# EAGLE design cp32m4_wrover (EAGLE 9.3.0)
COMPANY: ADAFRUIT INDUSTRIES; DRAWN: KTOWN; REV: B
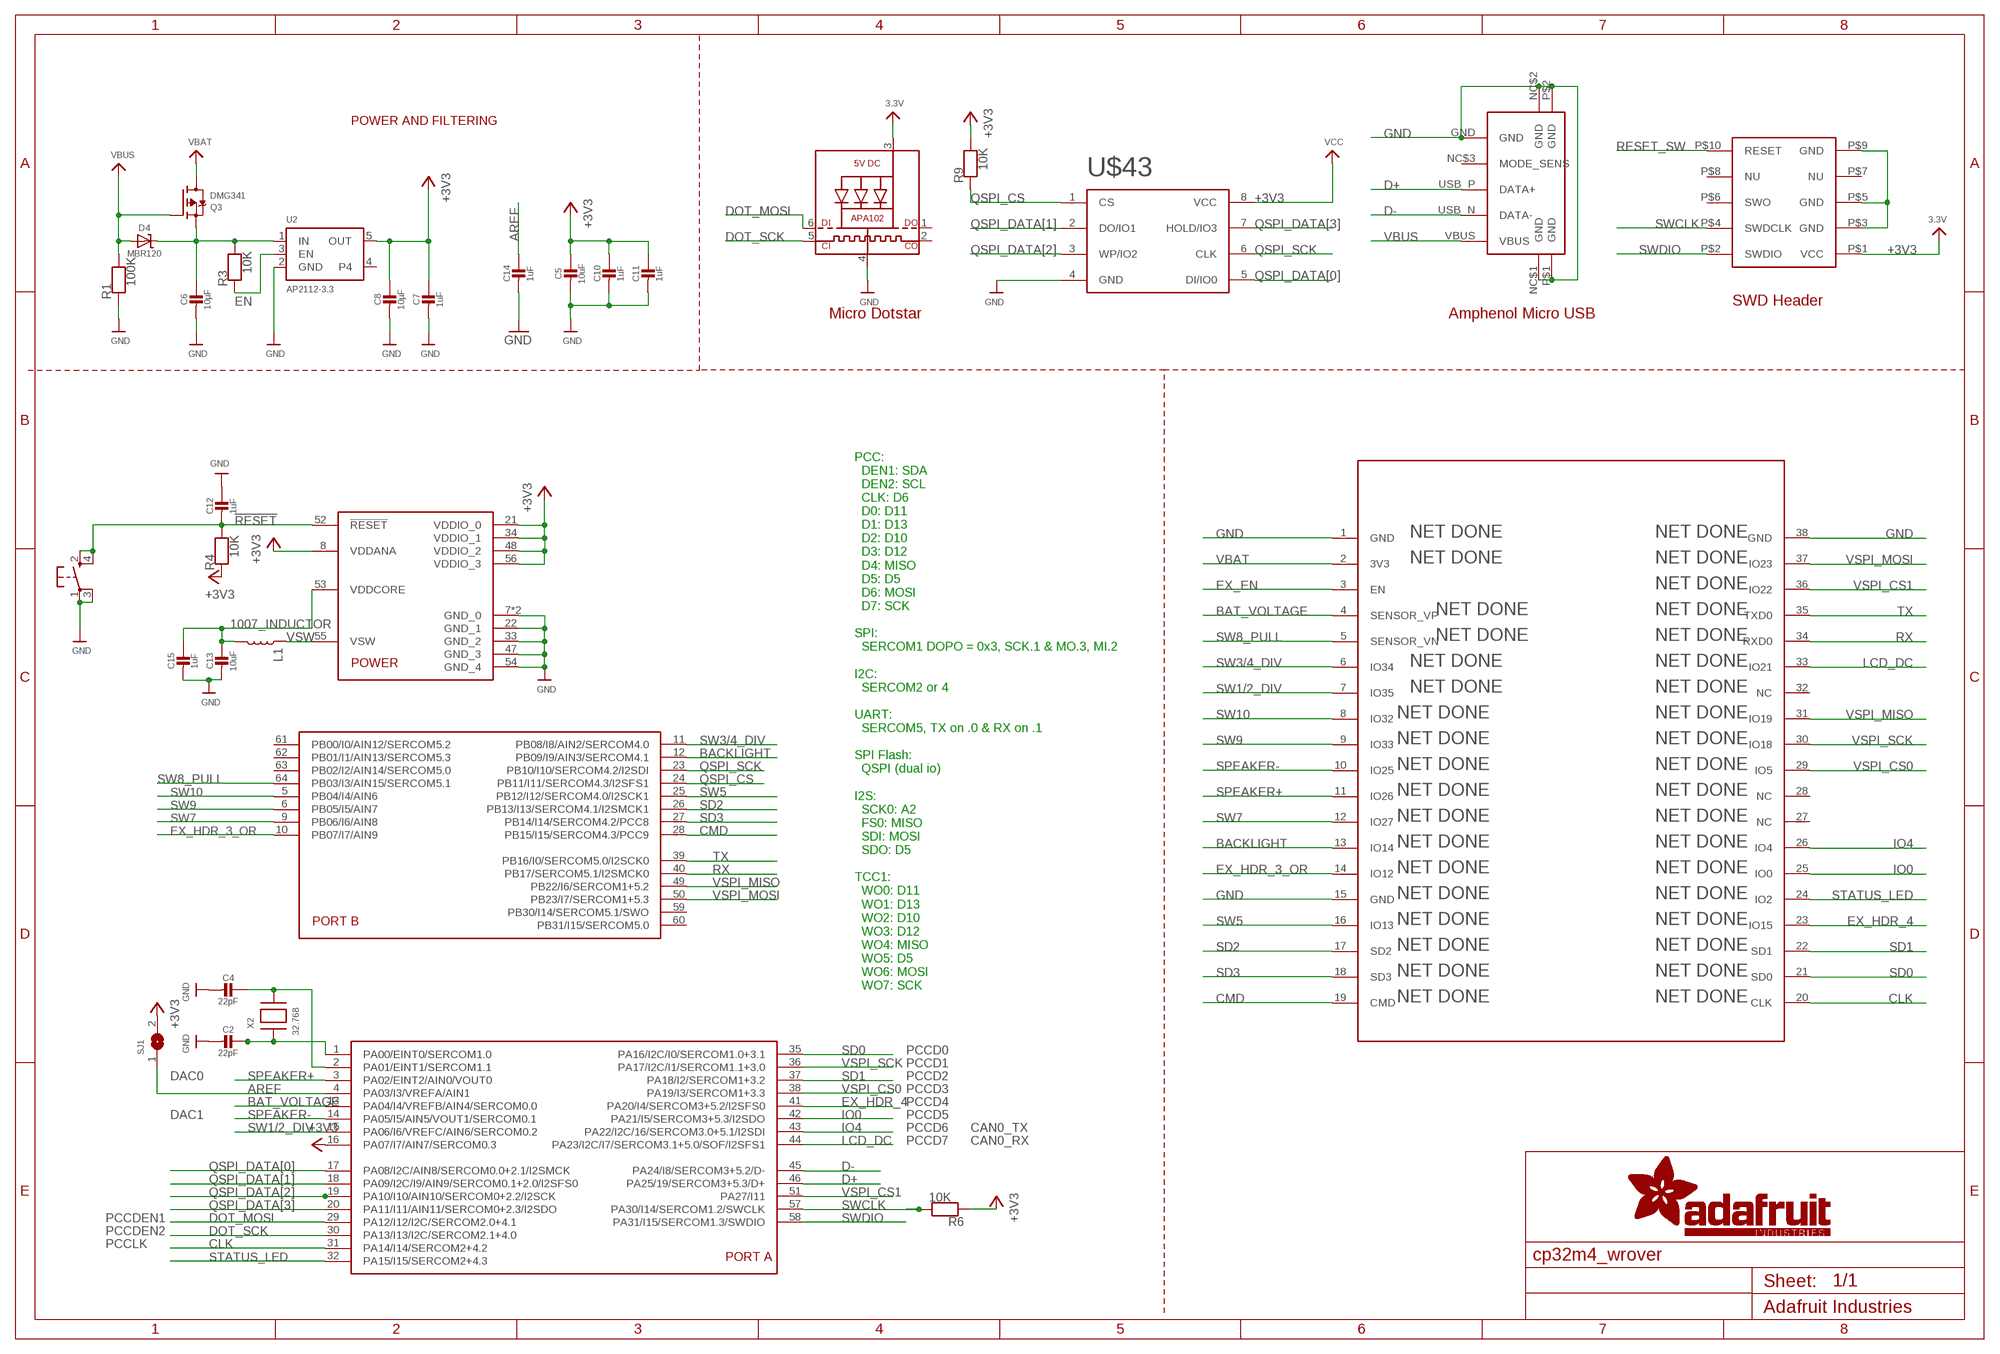
[diagram p0: schematic, sheet 1]

## Parts
C2  22pF  CAP_CERAMIC0603_NO  [0603-NO]
C4  22pF  CAP_CERAMIC0603_NO  [0603-NO]
C5  10uF  CAP_CERAMIC0805-NOOUTLINE  [0805-NO]
C6  10µF  CAP_CERAMIC0805-NOOUTLINE  [0805-NO]
C7  1uF  CAP_CERAMIC0603_NO  [0603-NO]
C8  10µF  CAP_CERAMIC0805-NOOUTLINE  [0805-NO]
C10  1uF  CAP_CERAMIC0603_NO  [0603-NO]
C11  1uF  CAP_CERAMIC0603_NO  [0603-NO]
C12  1uF  CAP_CERAMIC0603_NO  [0603-NO]
C13  10uF  CAP_CERAMIC0805-NOOUTLINE  [0805-NO]
C14  1uF  CAP_CERAMIC0603_NO  [0603-NO]
C15  1uF  CAP_CERAMIC0603_NO  [0603-NO]
D4  MBR120  DIODE-SCHOTTKYSOD-123  [SOD-123]
L1  1007_INDUCTOR  [1007_INDUCTOR]
LED2  AP102-2020  APA1022020  [APA102_2020]
Q3  DMG341  MOSFET-P  [SOT23-R]
R1  100K  RESISTOR_0603_NOOUT  [0603-NO]
R3  10K  RESISTOR_0603_NOOUT  [0603-NO]
R4  10K  RESISTOR_0603_NOOUT  [0603-NO]
R6  10K  RESISTOR_0603_NOOUT  [0603-NO]
R9  10K  RESISTOR_0603_NOOUT  [0603-NO]
SJ1  SOLDERJUMPERCLOSED  [SOLDERJUMPER_CLOSEDWIRE]
SW1  SPST_TACT-KMR2  [KMR2]
U2  AP2112-3.3  VREG_SOT23-5  [SOT23-5]
U$7  ESP32_WROVER  [ESP32_WROVER]
U$14  ATSAMD51J  [PQFN64-1]
U$43  WINDBOND_QSPI_FLASHWSON_6X5  [WSON_6X5MM]
U$44  SWD_HEADER  [AMPHENOL_SWD]
U$50  AMPHENOL_MICRO_USBAMPHENOL_MICRO_USB_BETTER  [BETTER_AMP_MICRO_USB]
X2  32.768  XTAL-3.2X1.5  [XTAL3215]

## Nets
!RESET: C12.2 R4.2 SW1.2(S) SW1.4(S1) U$14.52(!RESET)
+3V3: C5.1 C7.1 C8.1 C10.1 C11.1 LED2.3(VDD) R4.1 R6.1 R9.2 SJ1.2 U2.5(OUT) U$14.8(VDDANA) U$14.16(PA07/I7/AIN7/SERCOM0.3) U$14.21(VDDIO_0) U$14.34(VDDIO_1) U$14.48(VDDIO_2) U$14.56(VDDIO_3) U$43.8(VCC) U$44.P$1(VCC) ; supply symbol labelled 3.3V, VCC
AREF: C14.1 SJ1.1 U$14.4(PA03/I3/VREFA/AIN1)
BACKLIGHT: U$7.13(IO14) U$14.12(PB09/I9/AIN3/SERCOM4.1)
BAT_VOLTAGE: U$7.4(SENSOR_VP) U$14.13(PA04/I4/VREFB/AIN4/SERCOM0.0)
CLK: U$7.20(CLK) U$14.31(PA14/I14/SERCOM2+4.2)
CMD: U$7.19(CMD) U$14.28(PB15/I15/SERCOM4.3/PCC9)
D+: U$14.46(PA25/19/SERCOM3+5.3/D+) U$50.USB_P(DATA+)
D-: U$14.45(PA24/I8/SERCOM3+5.2/D-) U$50.USB_N(DATA-)
DOT_MOSI: LED2.6(DI) U$14.29(PA12/I12/I2C/SERCOM2.0+4.1)
DOT_SCK: LED2.5(CKI) U$14.30(PA13/I13/I2C/SERCOM2.1+4.0)
EN: R3.1 U2.3(EN)
EX_EN: U$7.3(EN)
EX_HDR_3_OR: U$7.14(IO12) U$14.10(PB07/I7/AIN9)
EX_HDR_4: U$7.23(IO15) U$14.41(PA20/I4/SERCOM3+5.2/I2SFS0)
GND [gnd]: C2.2 C4.2 C5.2 C6.2 C7.2 C8.2 C10.2 C11.2 C12.1 C13.2 C14.2 C15.2 LED2.4(GND) R1.1 SW1.1(P) SW1.3(P1) U2.2(GND) U$7.1(GND) U$7.15(GND) U$7.38(GND) U$14.7(GND_0) U$14.22(GND_1) U$14.33(GND_2) U$14.47(GND_3) U$14.54(GND_4) U$14.EXP(GND_0) U$43.4(GND) U$44.P$3(GND) U$44.P$5(GND) U$44.P$9(GND) U$50.GND U$50.NC$1(GND) U$50.NC$2(GND) U$50.P$1(GND) U$50.P$2(GND)
IO0: U$7.25(IO0) U$14.42(PA21/I5/SERCOM3+5.3/I2SDO)
IO4: U$7.26(IO4) U$14.43(PA22/I2C/16/SERCOM3.0+5.1/I2SDI)
LCD_DC: U$7.33(IO21) U$14.44(PA23/I2C/I7/SERCOM3.1+5.0/SOF/I2SFS1)
N$5: C2.1 U$14.1(PA00/EINT0/SERCOM1.0) X2.P$1
N$7: C4.1 U$14.2(PA01/EINT1/SERCOM1.1) X2.P$2
QSPI_CS: R9.1 U$14.24(PB11/I11/SERCOM4.3/I2SFS1) U$43.1(CS)
QSPI_DATA[0]: U$14.17(PA08/I2C/AIN8/SERCOM0.0+2.1/I2SMCK) U$43.5(DI/IO0)
QSPI_DATA[1]: U$14.18(PA09/I2C/I9/AIN9/SERCOM0.1+2.0/I2SFS0) U$43.2(DO/IO1)
QSPI_DATA[2]: U$14.19(PA10/I10/AIN10/SERCOM0+2.2/I2SCK) U$43.3(WP/IO2)
QSPI_DATA[3]: U$14.20(PA11/I11/AIN11/SERCOM0+2.3/I2SDO) U$43.7(HOLD/IO3)
QSPI_SCK: U$14.23(PB10/I10/SERCOM4.2/I2SDI) U$43.6(CLK)
RESET_SW: U$44.P$10(RESET)
RX: U$7.34(RXD0) U$14.40(PB17/SERCOM5.1/I2SMCK0)
SD0: U$7.21(SD0) U$14.35(PA16/I2C/I0/SERCOM1.0+3.1)
SD1: U$7.22(SD1) U$14.37(PA18/I2/SERCOM1+3.2)
SD2: U$7.17(SD2) U$14.26(PB13/I13/SERCOM4.1/I2SMCK1)
SD3: U$7.18(SD3) U$14.27(PB14/I14/SERCOM4.2/PCC8)
SPEAKER+: U$7.11(IO26) U$14.3(PA02/EINT2/AIN0/VOUT0)
SPEAKER-: U$7.10(IO25) U$14.14(PA05/I5/AIN5/VOUT1/SERCOM0.1)
STATUS_LED: U$7.24(IO2) U$14.32(PA15/I15/SERCOM2+4.3)
SW1/2_DIV: U$7.7(IO35) U$14.15(PA06/I6/VREFC/AIN6/SERCOM0.2)
SW3/4_DIV: U$7.6(IO34) U$14.11(PB08/I8/AIN2/SERCOM4.0)
SW5: U$7.16(IO13) U$14.25(PB12/I12/SERCOM4.0/I2SCK1)
SW7: U$7.12(IO27) U$14.9(PB06/I6/AIN8)
SW8_PULL: U$7.5(SENSOR_VN) U$14.64(PB03/I3/AIN15/SERCOM5.1)
SW9: U$7.9(IO33) U$14.6(PB05/I5/AIN7)
SW10: U$7.8(IO32) U$14.5(PB04/I4/AIN6)
SWCLK: R6.2 U$14.57(PA30/I14/SERCOM1.2/SWCLK) U$44.P$4(SWDCLK)
SWDIO: U$14.58(PA31/I15/SERCOM1.3/SWDIO) U$44.P$2(SWDIO)
TX: U$7.35(TXD0) U$14.39(PB16/I0/SERCOM5.0/I2SCK0)
VBAT [power]: Q3.3(D) U$7.2(3V3)
VBUS [power]: D4.A Q3.1(G) R1.2 U$50.VBUS
VDDCORE1: C13.1 C15.1 L1.P$2 U$14.53(VDDCORE)
VHI: C6.1 D4.C Q3.2(S) R3.2 U2.1(IN)
VSPI_CS0: U$7.29(IO5) U$14.38(PA19/I3/SERCOM1+3.3)
VSPI_CS1: U$7.36(IO22) U$14.51(PA27/I11)
VSPI_MISO: U$7.31(IO19) U$14.49(PB22/I6/SERCOM1+5.2)
VSPI_MOSI: U$7.37(IO23) U$14.50(PB23/I7/SERCOM1+5.3)
VSPI_SCK: U$7.30(IO18) U$14.36(PA17/I2C/I1/SERCOM1.1+3.0)
VSW: L1.P$1 U$14.55(VSW)
Unconnected: LED2.1(DO) LED2.2(CKO) U2.4 U$7.27(NC) U$7.28(NC) U$7.32(NC) U$14.59(PB30/I14/SERCOM5.1/SWO) U$14.60(PB31/I15/SERCOM5.0) U$14.61(PB00/I0/AIN12/SERCOM5.2) U$14.62(PB01/I1/AIN13/SERCOM5.3) U$14.63(PB02/I2/AIN14/SERCOM5.0) U$44.P$6(SWO) U$44.P$7(NU) U$44.P$8(NU) U$50.NC$3(MODE_SENS)

## Notes on the sheet
- POWER AND FILTERING
- SWD Header
- Micro Dotstar | Amphenol Micro USB
- NET DONE | NET DONE
- NET DONE | NET DONE
- NET DONE
- NET DONE | NET DONE
- NET DONE | NET DONE
- NET DONE | NET DONE
- NET DONE | NET DONE
- NET DONE | NET DONE
- NET DONE | NET DONE
- NET DONE | NET DONE
- NET DONE | NET DONE
- NET DONE | NET DONE
- NET DONE | NET DONE
- NET DONE | NET DONE
- NET DONE | NET DONE
- NET DONE | NET DONE
- NET DONE | NET DONE
- NET DONE | NET DONE
- PCC:
    DEN1: SDA
    DEN2: SCL
    CLK: D6
    D0: D11
    D1: D13
    D2: D10
    D3: D12
    D4: MISO
    D5: D5
    D6: MOSI
    D7: SCK
  
  SPI:
    SERCOM1 DOPO = 0x3, SCK.1 & MO.3, MI.2
  
  I2C:
    SERCOM2 or 4
  
  UART:
    SERCOM5, TX on .0 & RX on .1
  
  SPI Flash:
    QSPI (dual io)
  
  I2S:
    SCK0: A2
    FS0: MISO
    SDI: MOSI
    SDO: D5
  
  TCC1:
    WO0: D11
    WO1: D13
    WO2: D10
    WO3: D12
    WO4: MISO
    WO5: D5
    WO6: MOSI
    WO7: SCK
- NET DONE | NET DONE
- PCCD0
- PCCD1
- DAC0 | PCCD2
- PCCD3
- PCCD4
- DAC1 | PCCD5
- PCCD6 | CAN0_TX
- PCCD7 | CAN0_RX
- PCCDEN1
- PCCDEN2
- PCCLK

## Library data of the parts
C2 C4-C8 C10-C15 = microbuilder:CAP_CERAMIC: Ceramic Capacitors For new designs, use the packages preceded by an '_' character since they are more reliable: The following footprints should be used on most boards: _0402 - Standard footprint for regular board layouts _0603 - Standard footprint for regular board layouts _0805 - Standard footprint for regular board layouts _1206 - Standard footprint for regular board layouts For extremely tight-pitch boards where space is at a premium, the following 'micro-pitch' footprints can be used (smaller pads, no silkscreen outline, etc.): _0402MP - Micro-pitch footprint for very dense/compact boards _0603MP - Micro-pitch footprint for very dense/compact boards _0805MP - Micro-pitch footprint for very dense/compact boards _1206MP - Micro-pitch footprint for very dense/compact boards
D4 = microbuilder:DIODE-SCHOTTKY
L1 = 00_bsiepert:1007_INDUCTOR
LED2 = microbuilder:APA102: APA102/DotStar Pixels VCC: 5V DC Refresh Rate: 400Hz
Q3 = microbuilder:MOSFET-P: P-Channel Mosfet LEGEND VDS: Voltage Drain-Source ID: Drain Current RDS(ON): Drain-Source On-State Resistance VGS(TH): Gate-Source Threshold Voltage CISS: Drain-Source Input Capacitance SOT-23 Name VDS ID RDS(ON) VGS(TH) CISS Order Number IRLML5103 30V 760mA 600 mOhm -- 75pF @ 25V Digikey: IRLML5103PBFCT-ND IRLML6401 12V 4.3A 50 mOhm 950mV @ 250µA 830pF @ 10V Digikey: IRLML6401PBFTR-ND NTR0202PL 20V 400mA 800 mOhm 2.3V @ 250uA 70pF @ 5V Digikey: NTR0202PLT1GOSTR-ND NTR4101PT1G 20V 1.8A 85 mOhm 1.2V @ 250uA 675pF @ 10V Digikey: NTR4101PT1GOSCT-ND DMP2004K 20V 600mA 900 mOhm 1V @ 250uA 175pF @ 16V Digikey: DMP2004KDICT-ND PMV65XP 20V 3.9A 76 mOhm 950mV @ 1mA 725pF @ 20V Digikey: 568-2358-2-ND TO-252 Name VDS ID RDS(ON) VGS(TH) CISS Order Number AOD417 30V 25A 34 mOhm 3V @ 250µA 920pF @ 15V Digikey: 785-1106-2-ND PowerPak Name VDS ID RDS(ON) VGS(TH) CISS Order Number AON7401 30V 12A 14 mOhm 3V @ 250µA 2600pF @ 15V Digikey: 785-1302-1-ND
R1 R3 R4 R6 R9 = microbuilder:RESISTOR: Resistors For new designs, use the packages preceded by an '_' character since they are more reliable: The following footprints should be used on most boards: _0402 - Standard footprint for regular board layouts _0603 - Standard footprint for regular board layouts _0805 - Standard footprint for regular board layouts _1206 - Standard footprint for regular board layouts For extremely tight-pitch boards where space is at a premium, the following 'micro-pitch' footprints can be used (smaller pads, no silkscreen outline, etc.): _0402MP - Micro-pitch footprint for very dense/compact boards _0603MP - Micro-pitch footprint for very dense/compact boards _0805MP - Micro-pitch footprint for very dense/compact boards _1206MP - Micro-pitch footprint for very dense/compact boards
SJ1 = microbuilder:SOLDERJUMPER: SMD Solder JUMPER Solder the two pads together to create a connection, or remove the solder to break it. REFLOW - Use this footprint for solder paste and reflow ovens. WAVE - Use this footprint for hand-soldering (larger pads). CLOSED - Has a trace between the two pads to ensure it is closed by default. The trace needs to be cut to disable the jumper, and can be closed again by creating a solder bridge between the two pads.
SW1 = adafruit:SPST_TACT: SMT 6mm switch, EVQQ2 series http://www.ladyada.net/library/eagle
U2 = microbuilder:VREG_SOT23-5: SOT23-5 Fixed Voltage Regulators Part Current Out V Out V In V Dropout θJA (°C/W) TJ (°C) Digikey Part No. ADP121 150mA 3.3V 3.4-5.5V 0.09V @ 150mA -- -- ADP121-AUJZ33R7CT-ND ADP121 150mA 3.0V 3.1-5.5V 0.09V @ 150mA -- -- ADP121-AUJZ30R7CT-ND ADP122 300mA 3.3V 3.4-5.5V 0.085V @ 300mA -- -- ADP122AUJZ-3.3-R7CT-ND ADP1712 300mA 3.3V 3.5-5.5V 0.17V @ 300mA -- -- ADP1712AUJZ-3.3-R7TR-ND AP7311 (Low Cost) 150mA 3.3V 3.5-6V 0.15V @ 150mA -- -- AP7311-33WG-7DICT-ND LD39015M18R 150mA 1.8V 1.9V-5.5V 0.08V @ 100mA -- -- 497-6977-1-ND LP2985A-33DBVR 150mA 3.3V 3.3-16V 0.28V @ 150mA 206 150 296-18479-1-ND MCP1824T-3302E/OT 300mA 3.3V 3.5V-6V 0.2V @ 300mA -- -- MCP1824T-3302E/OTCT-ND MIC5205-2.5YM5 TR 150mA 2.5V 2.7-16V 0.165V @ 150mA -- -- 576-1257-2-ND MIC5205-3.0YM5 TR 150mA 3.0V 3.2V-16V 0.165V @ 150mA -- -- 576-1258-2-ND MIC5205-3.3YM5 TR 150mA 3.3V 3.5V-16V 0.165V @ 150mA -- -- 576-1259-2-ND TPS780330220 150mA 3.3V+2.2V 3.6-5.5V 250mV Max -- -- 296-23332-1-ND TDA3663/N1,135 100mA 3.3V 3.5-45V 0.18V @ 50mA -- -- 568-5343-1-ND Max operating temp can be calculated using θJA, TJ (max junction temperature), and power in watts. Set the "Maximum Ambient Temperature" until it reaches TJ ("Max Junction Temperature"), which is the absolute limit for safe use of the regulator: Heat Sink Temperature Calculator <http://www.daycounter.com/Calculators/Heat-Sink-Temperature-Calculator.phtml> For example, With 12V source into a 3.3V LP2985 and a 30mA load, we are dissipating (12V-3.3V) * 0.03A = 0.261W. With a θJA of 206 °C/W, a TJ of 150°C, and 261mW we can safely use the chip without a heat sink up to 75°C (=147.1°C Junction Temperature).
U$7 = 00_bsiepert:ESP32_WROVER
U$14 = microbuilder:ATSAMD51J: ATSAMD51J cortex m4 microcontroller
U$43 = 00_bsiepert:WINDBOND_QSPI_FLASH
U$44 = 00_bsiepert:SWD_HEADER
U$50 = 00_bsiepert:AMPHENOL_MICRO_USB
X2 = adafruit2:XTAL: Low cost SMT crystals, no capacitors included http://www.ladyada.net/library/eagle

## Net classes
1 power: width 0.305 mm
2 gnd: width 0.254 mm

## Board
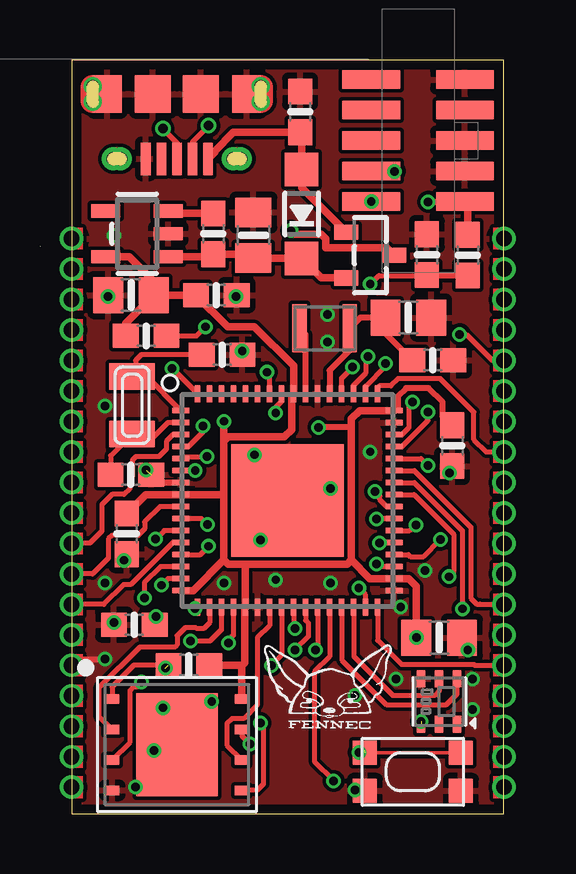
[diagram p1: board, top side]
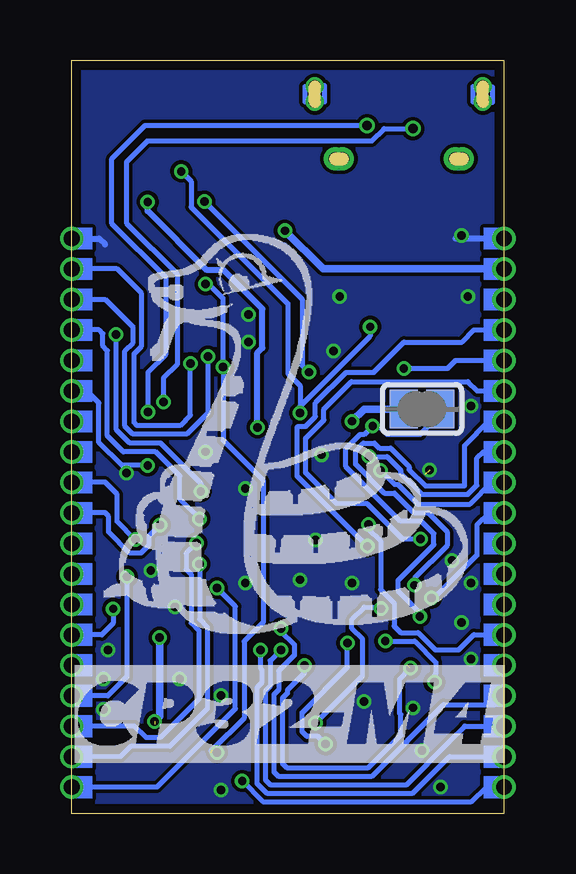
[diagram p2: board, bottom side, seen from below]

Size 18 x 31.4 mm. Coordinates in mm from the lower left corner, seen from the top.
Outline: 14.4,31.4 8.05,31.4
Copper layers (1*16): Top 0.035559375mm / dielectric 1.6mm / Bottom 0.035559375mm
Design rules "oshpark-2layer-tented *": minimum track width 6mil, minimum drill 10mil, track to track 6mil, track to pad 6mil, pad to pad 6mil, via to via 6mil, smd to smd 6mil, copper to edge 15mil, drill to drill 6mil, minimum pad ring 5mil, minimum via ring 5mil, stop-mask expansion 2.5mil, vias tented up to drill 20mil, thermal gap 10mil

### Footprints (pad centres in the part's own frame; a part is rotated, then mirrored left to right if it is on the bottom)
0603-NO = smd 1.075 x 1: 1 -0.85,0; 2 0.85,0
0805-NO = smd 1.24 x 1.5: 1 -0.95,0; 2 0.95,0
SOD-123 = smd 1.4 x 1.4: A 1.85,0; C -1.85,0
1007_INDUCTOR = smd 0.6 x 2: P$1 -1.05,0; P$2 1.05,0
APA102_2020 = smd 0.7 x 0.35: 1 -0.95,-0.75; 2 -0.95,0; 3 -0.95,0.75; 4 0.95,0.75; 5 0.95,0; 6 0.95,-0.75
SOT23-R = smd 0.635 x 1.016: 1 -0.95,-1; 2 0.95,-1; 3 0,1
SOLDERJUMPER_CLOSEDWIRE = smd 1.168 x 1.6: 1 -0.762,0; 2 0.762,0 | smd 0.635 x 0.203: WIRE 0,0
KMR2 = smd 1 x 1: 1 2,0.8; 2 2,-0.8; 3 -2,0.8; 4 -2,-0.8
SOT23-5 = smd 0.55 x 1.2: 1 -0.95,-1.3; 2 0,-1.3; 3 0.95,-1.3; 4 0.95,1.3; 5 -0.95,1.3
ESP32_WROVER = drill 0.65 pad 0.904: 1 -9.009,15.36; 2 -9.009,14.09; 3 -9.009,12.82; 4 -9.009,11.55; 5 -9.009,10.28; 6 -9.009,9.01; 7 -9.009,7.74; 8 -9.009,6.47; 9 -9.009,5.2; 10 -9.009,3.93; 11 -9.009,2.66; 12 -9.009,1.39; 13 -9.009,0.12; 14 -9.009,-1.15; 15 -9.009,-2.42; 16 -9.009,-3.69; 17 -9.009,-4.96; 18 -9.009,-6.23; 19 -9.009,-7.5; 20 9.009,-7.5; 21 9.009,-6.23; 22 9.009,-4.96; 23 9.009,-3.69; 24 9.009,-2.42; 25 9.009,-1.15; 26 9.009,0.12; 27 9.009,1.39; 28 9.009,2.66; 29 9.009,3.93; 30 9.009,5.2; 31 9.009,6.47; 32 9.009,7.74; 33 9.009,9.01; 34 9.009,10.28; 35 9.009,11.55; 36 9.009,12.82; 37 9.009,14.09; 38 9.009,15.36
PQFN64-1 = smd 0.7 x 0.22: 1 -4.45,3.75; 2 -4.45,3.25; 3 -4.45,2.75; 4 -4.45,2.25; 5 -4.45,1.75; 6 -4.45,1.25; 7 -4.45,0.75; 8 -4.45,0.25; 9 -4.45,-0.25; 10 -4.45,-0.75; 11 -4.45,-1.25; 12 -4.45,-1.75; 13 -4.45,-2.25; 14 -4.45,-2.75; 15 -4.45,-3.25; 16 -4.45,-3.75; 33 4.45,-3.75; 34 4.45,-3.25; 35 4.45,-2.75; 36 4.45,-2.25; 37 4.45,-1.75; 38 4.45,-1.25; 39 4.45,-0.75; 40 4.45,-0.25; 41 4.45,0.25; 42 4.45,0.75; 43 4.45,1.25; 44 4.45,1.75; 45 4.45,2.25; 46 4.45,2.75; 47 4.45,3.25; 48 4.45,3.75 | smd 0.22 x 0.7: 17 -3.75,-4.45; 18 -3.25,-4.45; 19 -2.75,-4.45; 20 -2.25,-4.45; 21 -1.75,-4.45; 22 -1.25,-4.45; 23 -0.75,-4.45; 24 -0.25,-4.45; 25 0.25,-4.45; 26 0.75,-4.45; 27 1.25,-4.45; 28 1.75,-4.45; 29 2.25,-4.45; 30 2.75,-4.45; 31 3.25,-4.45; 32 3.75,-4.45; 49 3.75,4.45; 50 3.25,4.45; 51 2.75,4.45; 52 2.25,4.45; 53 1.75,4.45; 54 1.25,4.45; 55 0.75,4.45; 56 0.25,4.45; 57 -0.25,4.45; 58 -0.75,4.45; 59 -1.25,4.45; 60 -1.75,4.45; 61 -2.25,4.45; 62 -2.75,4.45; 63 -3.25,4.45; 64 -3.75,4.45 | smd 4.7 x 4.7: EXP 0,0
WSON_6X5MM = smd 0.6 x 0.4: 1 -2.7,1.905; 2 -2.7,0.635; 3 -2.7,-0.635; 4 -2.7,-1.905; 5 2.7,-1.905; 6 2.7,-0.635; 7 2.7,0.635; 8 2.7,1.905 | smd 3.4 x 4.3: PAD 0,0
AMPHENOL_SWD = smd 0.76 x 2.4: P$1 -2.54,-1.95; P$2 -2.54,1.95; P$3 -1.27,-1.95; P$4 -1.27,1.95; P$5 0,-1.95; P$6 0,1.95; P$7 1.27,-1.95; P$8 1.27,1.95; P$9 2.54,-1.95; P$10 2.54,1.95
BETTER_AMP_MICRO_USB = smd 0.4 x 1.35: GND 1.3,2.7; NC$3 0.65,2.7; USB_N -0.65,2.7; USB_P 0,2.7; VBUS -1.3,2.7 | smd 1.5 x 1.55: NC$1 -1,0; NC$2 1,0 | smd 1.2 x 1.55: P$1 -2.9,0; P$2 2.9,0 | drill 0.5: P$3 -3.5,0.325; P$4 -3.5,-0.325; P$5 3.5,-0.325; P$6 3.5,0.325 | drill 0.55 pad 0.95: P$7 -2.65,2.7; P$8 -2.35,2.7; P$9 2.35,2.7; P$10 2.65,2.7
XTAL3215 = smd 1.1 x 1.9: P$1 1.2,0; P$2 -1.2,0

### Placement (x,y rotation side)
C2  6.26,19.12 0 top
C4  2.46,14.12 0 top
C5  15.3,7.33 0 top
C6  7.56,24.1 90 top
C7  6.02,21.6 0 top
C8  2.46,21.6 180 top
C10  2.28,11.66 270 top
C11  15.85,15.33 270 top
C12  14.79,23.29 270 top
C13  14.02,20.66 0 top
C14  2.6,7.87 180 top
C15  15.03,18.89 0 top
D4  9.57,24.98 90 top
L1  10.52,20.22 0 top
LED2  15.3,4.67 90 top
Q3  12.43,23.27 270 top
R1  9.51,29.24 270 top
R3  5.89,24.16 270 top
R4  16.49,23.27 270 top
R6  3.09,19.9 0 top
R9  4.87,6.19 0 top
SJ1  3.41,16.85 180 bottom
SW1  14.21,1.74 180 top
U2  2.71,24.16 90 top
U$7  9,8.6 0 top
U$14  8.99,13.04 0 top
U$43  4.38,2.87 0 top
U$44  14.42,28.04 90 top
U$50  4.37,29.98 180 top
X2  2.51,17.02 90 top

### Tracks (layer width: path | path; a pad name or v marks a point on that pad's centre or on a via)
!RESET  (via drill 0.35)  (1 unrouted)
  Top 0.152: SW1.2 SW1.4
  Top 0.203: U$14.52 11.24,18.14 v11.7,18.6 | v12.43,22.06 12.79,22.42 14.82,22.42
  Top 0.254: R4.2 14.82,22.42 C12.2 | SW1.2 12.3,2.63 | 16.12,2.63 SW1.4
  Bottom 0.203: v12.43,22.06 12.3,22.06 11.7,21.46 v11.7,18.6 11.7,15.55 10.04,13.89 10.04,7.97 10.83,7.18 10.83,3.98 12.18,2.63
  Bottom 0.254: 12.18,2.63 12.04,2.63 v11.95,2.54
+3V3  (via drill 0.35)  (1 unrouted)
  Top 0.254: C11.1 15.44,16.59 15.44,17.15 14.87,17.73 13.93,17.73 13.59,17.39 13.59,16.94 U$14.48 | 11.64,16.09 v10.27,16.09 | v14.84,25.49 16.36,25.49 U$44.P$1
  Top 0.305: 1.61,23.21 U2.5 2.39,23.21 3.41,22.19 C8.1 | C8.1 C7.1 6.48,20.28 7.6,20.28 9.24,18.65 U$14.56 9.15,17.41 9.15,16 8.85,15.7 6.51,15.7 6.33,15.52 | U$44.P$1 16.49,25.38 R4.1 | 6.33,10.57 6.51,10.39 7.22,10.39 | 6.33,13.3 6.33,15.52 | 6.33,13.3 6.33,10.57 | 7.22,10.39 7.22,8.61 U$14.21 7.2,8.56 7.2,6.29 7.08,6.17 | 6.33,13.3 6.33,13.29 U$14.8 3.07,13.29 C10.1 | 7.22,10.39 11.46,10.39 11.64,10.57 | U$14.48 11.99,16.8 11.64,16.45 11.64,16.09 11.64,10.57 | 11.64,10.57 12.41,9.79 U$14.34 14.03,9.79 14.35,9.47 C5.1 | 6.33,15.52 v6.33,16.35 | 6.33,10.57 5.06,9.29 U$14.16 | 7.08,6.17 7.08,6.19 R9.2 | 7.08,6.17 U$43.8 | C8.1 2.24,20.43 R6.1 | 15.47,16.56 C11.1
  Bottom 0.254: v10.27,16.09 10.27,19.21 10.07,19.41 10.07,21.03 11.68,22.64 12.38,22.64 14.84,25.11 v14.84,25.49
  Bottom 0.305: v6.33,16.35 5.82,16.85 SJ1.2 | C5.1 14.35,4.05 v14.55,3.84
  other vias: 14.35,7.33
AREF  (via drill 0.35)
  Top 0.203: U$14.4 4.86,15.3 5.47,15.91 v5.47,16.14 | v3.51,8.22 3.45,8.16 C14.1
  Bottom 0.203: SJ1.1 2.84,16.66 2.84,16.45 3.48,15.8 4.86,15.8 5.21,16.14 v5.47,16.14 5.82,15.79 6,15.79 6.59,15.2 6.59,14.45 4.31,12.18 3.44,12.18 2.92,11.66 2.92,11.2 4.41,9.71 4.41,9.28 3.51,8.38 v3.51,8.22
BACKLIGHT
  Top 0.203: U$14.12 4.19,11.29 2.44,9.54 2.16,9.54 1.33,8.72 U$7.13
BAT_VOLTAGE  (via drill 0.35)
  Top 0.203: U$14.13 5.35,10.79 v5.69,11.14
  Bottom 0.203: U$7.4 1.24,20.15 1.74,19.65 4.17,19.65 5.44,18.38 6.59,18.38 7.86,17.11 7.86,16.54 8.26,16.13 8.58,16.13 8.62,16.09 8.62,14.06 v5.69,11.14
CLK  (via drill 0.35)
  Top 0.203: U$14.31 12.24,9.11 v11.95,9.4
  Bottom 0.203: v11.95,9.4 11.19,8.64 11.19,4.38 14.46,1.11 U$7.20
CMD  (via drill 0.35)
  Top 0.203: v10.91,1.36 10.1,2.16 10.1,5.91 10.74,6.54 U$14.28
  Bottom 0.203: U$7.19 0.74,1.11 1.36,0.49 10.04,0.49 v10.91,1.36
D+  (via drill 0.35, 0.39)
  Top 0.203: U$50.USB_P 4.38,27.96 v3.79,28.54 | U$14.46 13.76,15.8 14.04,16.08 14.04,17 v14.19,17.15
  Bottom 0.203: v3.79,28.54 4.99,28.54 5.5,28.03 14.84,28.03 15.73,27.14 15.73,24.6 13.62,22.49 13.62,18.71 14.19,18.14 v14.19,17.15
D-  (via drill 0.35, 0.39)
  Top 0.203: U$50.USB_N 5.03,27.99 v5.7,28.67 | U$14.45 13.77,15.3 14.83,16.37 v14.83,16.74
  Bottom 0.203: v5.7,28.67 14.96,28.67 16.34,27.29 16.34,24.58 14.08,22.32 14.08,19.14 14.83,18.39 v14.83,16.74
DOT_MOSI
  Top 0.203: U$14.29 11.25,8.59 11.25,6.39 13.1,4.54 15.6,4.54 16.05,4.98 LED2.6
DOT_SCK
  Top 0.203: U$14.30 11.75,8.59 11.75,6.55 13.38,4.92 15.11,4.92 15.3,5.11 LED2.5
EN
  Top 0.305: R3.1 4.11,25.01 U2.3
EX_HDR_3_OR  (via drill 0.35)
  Top 0.203: v5.65,12.04 5.39,12.29 U$14.10
  Bottom 0.203: U$7.14 1.25,7.46 1.89,6.82 2.86,6.82 3.58,7.54 4.3,7.54 4.57,7.81 4.57,8.77 5.14,9.33 5.14,11.37 5.65,11.88 v5.65,12.04
EX_HDR_4  (via drill 0.35)
  Top 0.203: U$14.41 14.26,13.29 15.91,11.64 15.91,10.07 v15.71,9.87
  Bottom 0.203: v15.71,9.87 15.71,5.7 16.5,4.91 U$7.23
GND  (via drill 0.35)  (1 unrouted)
  Top 0.254: U$7.15 0.25,6.44 v1.38,6.44 | U$14.7 3.64,13.79 C4.2 | v5.82,4.66 4.05,4.66 v3.79,4.41 | v3.41,2.63 3.29,2.5 3.29,1.61 2.78,1.11 v2.65,1.11 | U$14.EXP 9.49,13.55 v10.78,13.55 | U$14.EXP 7.86,11.92 v7.86,11.39 | U$14.EXP 8.99,13.57 v7.6,14.95
  Bottom 0.254: U$7.1 2.01,23.96 2.01,23.97 | U$7.38 16.87,23.96 16.62,23.71
  other vias: 8.49,9.74 6.33,9.62 11.79,4.92 14.71,10.12 6.84,21.55 1.38,16.98 11.79,0.98 2.17,10.56 3.09,14.31 10.65,19.65 10.65,20.79 7.09,19.27 15.73,14.19 10.78,9.62 13.7,8.6 1.51,21.55 1.76,24.09 1.76,7.96 16.49,6.82 16.68,5.62 16.68,4.35 13.51,5.62 12.43,15.08 1.38,9.62
  pour Bottom: -0.02,31.59 18.02,31.59 18.02,-0.16 -0.02,-0.16
  pour Top: -0.02,31.46 18.02,31.46 18.02,-0.04 -0.02,-0.04
IO0  (via drill 0.35)
  Top 0.203: U$14.42 13.45,13.79 14.27,13.79 16.26,11.79 16.26,8.83 16.28,8.82 v16.28,8.53
  Bottom 0.203: v16.28,8.53 16.28,7.92 16.75,7.45 U$7.25
IO4
  Top 0.203: U$14.43 13.45,14.29 14.27,14.29 16.62,11.94 16.62,8.98 16.87,8.73 17,8.73 17.01,8.72 U$7.26
LCD_DC  (via drill 0.35)
  Top 0.203: U$14.44 14.55,14.79 v14.84,14.51
  Bottom 0.203: v14.84,14.51 15.92,14.51 16.87,15.46 16.87,17.11 17.38,17.61 U$7.33
N$5
  Top 0.203: U$14.1 3.11,18.22 2.65,18.22 | 2.65,18.22 X2.P$1 | C2.1 2.88,19.12 2.65,18.89 2.65,18.22
N$7
  Top 0.203: U$14.2 3.99,16.3 3.29,15.58 2.74,15.58 X2.P$2 1.61,14.92 C4.1
QSPI_CS  (via drill 0.35)  (1 unrouted)
  Top 0.203: U$14.24 8.74,6.6 v8.31,6.17 | R9.1 2.58,6.19 1.68,5.28 U$43.1
  Bottom 0.203: v8.31,6.17 8.31,5.86 9.03,5.14 9.03,5.01 9.23,4.81 9.23,2.1 9.05,1.92 5.64,1.92 4.3,3.26 4.3,4.13 4.35,4.18 4.35,5.61 v3.9,6.06
QSPI_DATA[0]  (via drill 0.35)
  Top 0.203: U$14.17 5.18,8.59 v5.13,8.54 | U$43.5 7.72,0.97 7.98,1.23 7.98,3.65 v7.86,3.77
  Bottom 0.203: v7.86,3.77 5.89,5.74 5.89,7.27 6.33,7.71 6.33,8.09 5.82,8.6 5.19,8.6 v5.13,8.54
QSPI_DATA[1]
  Top 0.203: U$14.18 5.74,7.95 5.49,7.71 5.2,7.71 5.17,7.74 4.71,7.74 4.39,7.41 4.39,7.03 4.3,6.94 2.83,6.94 1.12,5.23 1.12,4.06 U$43.2
QSPI_DATA[2]  (via drill 0.35)
  Top 0.203: U$14.19 6.23,8.59 6.23,7.66 5.75,7.18 v4.94,7.18 | U$43.3 2.42,2.98 2.42,5.13 2.57,5.28 2.7,5.28 v2.9,5.48
  Bottom 0.203: v2.9,5.48 2.9,5.76 2.83,5.83 2.83,6.29 3.73,7.18 v4.94,7.18
QSPI_DATA[3]  (via drill 0.35)
  Top 0.203: U$43.7 7.08,3.24 v7.43,2.89 | v6.53,7.11 6.53,7.24 6.74,7.45 U$14.20
  Bottom 0.203: v7.43,2.89 7.75,3.22 8.21,3.22 8.41,3.42 8.41,4.21 6.53,6.09 v6.53,7.11
QSPI_SCK
  Top 0.203: U$43.6 6.46,2.85 6.46,3.75 6.67,3.96 7.15,3.96 7.73,4.54 7.73,7.33 8.24,7.84 U$14.23
RX  (via drill 0.35)
  Top 0.203: v12.63,13.43 12.83,13.23 12.83,13.08 13.12,12.79 U$14.40 | v16.16,19.97 16.43,19.97 17.52,18.88 U$7.34
  Bottom 0.203: v12.63,13.43 12.63,13.75 14.31,15.43 15.59,15.43 16.15,16 v16.15,19.96 v16.16,19.97
SD0  (via drill 0.35)
  Top 0.203: U$14.35 12.79,10.29 v12.68,10.4
  Bottom 0.203: v12.68,10.4 12.68,8.1 12.36,7.77 12.36,4.37 13.92,2.81 15.56,2.81 15.98,2.38 U$7.21
SD1  (via drill 0.35)
  Top 0.203: U$14.37 12.83,11.29 v12.81,11.27
  Bottom 0.203: v12.81,11.27 13.24,10.84 13.24,10.17 13.04,9.97 13.04,7.95 12.71,7.62 12.71,4.77 14.32,3.16 14.91,3.16 15.4,3.65 U$7.22
SD2  (via drill 0.35)
  Top 0.203: U$14.26 9.74,8.05 9.85,7.94 9.85,7.38 v9.29,6.82
  Bottom 0.203: v9.29,6.82 9.74,6.37 9.74,5.3 9.94,5.1 9.94,1.4 9.74,1.21 4.05,1.21 2.27,2.98 2.27,3.01 1.63,3.65 1.63,3.64 U$7.17
SD3  (via drill 0.35)
  Top 0.203: U$14.27 10.24,6.82 v10.14,6.82
  Bottom 0.203: v10.14,6.82 10.14,6.06 10.09,6.01 10.09,5.45 10.29,5.25 10.29,1.25 9.89,0.85 3.79,0.85 2.28,2.37 U$7.18
SPEAKER+
  Top 0.203: U$14.3 4.53,15.79 4.21,15.79 3.93,15.51 3.93,15.19 3.62,14.88 2.67,14.88 2.52,14.73 2.52,14.06 2.4,13.94 2.4,13.52 2.18,13.3 1.67,13.3 1.25,12.88 1.25,11.77 0.74,11.27 U$7.11
SPEAKER-  (via drill 0.35)
  Top 0.203: U$14.14 3.7,10.29 3.02,9.62 v3.02,8.99
  Bottom 0.203: v3.02,8.99 2.9,8.99 1.13,10.76 1.13,12.03 0.62,12.54 U$7.10
STATUS_LED
  Top 0.203: U$14.32 12.74,7.21 13.73,6.22 16.75,6.22 16.79,6.18 U$7.24
SW1/2_DIV  (via drill 0.35)
  Top 0.203: U$14.15 4.01,9.79 v3.73,9.52
  Bottom 0.203: v3.73,9.52 3.73,9.8 2.37,11.16 2.37,11.75 3.16,12.54 3.75,12.54 4.57,13.36 4.99,13.36 6.18,14.55 6.18,15.11 5.86,15.43 5.39,15.43 5.2,15.23 4.72,15.23 3.95,14.46 3.95,14.33 3.26,13.65 1.65,13.65 1.63,13.67 1.63,15.33 0.62,16.34 U$7.7
SW3/4_DIV  (via drill 0.35)
  Top 0.203: U$14.11 3.84,11.79 v3.48,11.43
  Bottom 0.203: v3.48,11.43 4.21,11.43 5.7,12.92 6.97,12.92 8.26,14.21 8.26,15.63 7.5,16.39 7.5,16.85 6.36,18 1.51,18 1.12,17.61 U$7.6
SW5  (via drill 0.35)
  Top 0.203: U$14.25 9.24,7.77 v9.29,7.71
  Bottom 0.203: v9.29,7.71 9.29,7.61 8.74,7.05 8.74,6.59 9.38,5.94 9.38,5.15 9.58,4.95 9.58,1.74 9.4,1.56 5.5,1.56 2.52,4.54 0.36,4.54 U$7.16
SW7
  Top 0.203: U$14.9 3.67,12.79 3.03,12.16 3.03,11.86 2.76,11.6 1.67,11.6 1.52,11.45 1.52,10.65 0.86,9.99 U$7.12
SW8_PULL  (via drill 0.35)
  Top 0.203: U$14.64 v4.18,18.55 v4.17,18.55
  Bottom 0.203: v4.17,18.55 2.35,18.55 2.01,18.89 U$7.5
SW9  (via drill 0.35)
  Top 0.203: U$14.6 v5.14,14.29
  Bottom 0.203: v5.14,14.29 4.56,13.71 4.42,13.71 3.6,12.89 1.4,12.89 0.5,13.8 U$7.9
SW10  (via drill 0.35)
  Top 0.203: U$14.5 4.62,14.88 v5.63,14.88
  Bottom 0.203: U$7.8 0.87,15.08 1.13,14.82 1.13,13.68 1.51,13.3 3.41,13.3 4.3,14.19 4.3,14.31 4.86,14.88 v5.63,14.88
SWCLK  (via drill 0.35)
  Top 0.203: U$14.57 8.73,17.49 8.73,17.17 8.49,16.93 v8.49,16.69 | v13.45,26.76 12.49,26.76 U$44.P$4 | R6.2 5.19,19.9 v5.57,20.28
  Bottom 0.203: v5.57,20.28 5.57,19.9 8.49,16.98 v8.49,16.69 8.49,17.83 9,18.34 9,21.24 13.03,25.27 13.03,26.34 v13.45,26.76
SWDIO  (via drill 0.35)
  Top 0.203: U$14.58 8.24,18.28 v8.12,18.39
  Bottom 0.203: v8.12,18.39 8.41,18.68 8.41,21.44 U$44.P$2
  other vias: 12.47,25.5
TX  (via drill 0.35)
  Top 0.203: U$14.39 12.7,12.29 v12.68,12.28
  Bottom 0.203: v12.68,12.28 13.5,13.1 13.5,14.07 14.51,15.08 15.86,15.08 16.52,15.74 16.52,19.29 16.71,19.48 16.71,19.99 16.87,20.15 U$7.35
VBAT  (via drill 0.35)
  Top 0.305: Q3.3 13.11,23.59 10.58,23.59 10.58,23.96 10.4,24.14 9.28,24.14 v9.13,24.29
  Bottom 0.305: v9.13,24.29 7.54,22.7 U$7.2
VBUS
  Top 0.305: U$50.VBUS 5.95,27.55 5.95,27.6 6.73,28.39 R1.2 9.57,28.32 D4.A 9.57,26.08 Q3.1
VDDCORE1
  Top 0.254: C15.1 13.07,20 C13.1 12.02,20.66 L1.P$2 11.57,19.3 10.74,18.46 U$14.53
VHI
  Top 0.305: U2.1 5.79,23.21 R3.2 7.4,23.31 C6.1 9.56,23.15 D4.C 10.39,22.32 Q3.2
VSPI_CS0  (via drill 0.35)
  Top 0.203: U$14.38 14.08,11.79 14.1,11.82 14.13,11.82 v14.33,12.02
  Bottom 0.203: v14.33,12.02 14.8,11.56 14.8,11.18 15.12,10.86 15.58,10.86 16.47,11.74 16.47,12.38 16.62,12.54 U$7.29
VSPI_CS1  (via drill 0.35)
  Top 0.203: U$14.51 11.74,17.85 12.25,18.37 12.25,18.97 v12.33,19.04
  Bottom 0.203: v12.33,19.04 12.33,16.71 13.22,15.81 15.46,15.81 15.79,16.14 15.79,19.28 15.45,19.62 15.45,20.26 16.62,21.43 U$7.36
VSPI_MISO
  Top 0.203: U$14.49 12.74,17.75 12.81,17.82 13.29,17.82 13.59,18.12 15.35,18.12 16.75,16.73 16.75,15.58 17.26,15.07 U$7.31
VSPI_MOSI  (via drill 0.35)
  Top 0.203: v13.06,18.76 13.06,18.64 12.24,17.81 U$14.50
  Bottom 0.203: v13.06,18.76 13.06,16.6 13.5,16.17 15.29,16.17 15.41,16.3 15.41,19.16 15.1,19.48 15.1,21.68 16.11,22.7 U$7.37
VSPI_SCK  (via drill 0.35)
  Top 0.203: U$14.36 14.02,10.79 14.1,10.71 14.65,10.71 v15.35,11.41
  Bottom 0.203: v15.35,11.41 16.11,12.17 16.11,13.3 16.62,13.81 U$7.30
VSW
  Top 0.254: U$14.55 9.74,19.96 L1.P$1

### Text on the board
201bmp: /Users/bsiepert/Desktop/blinka_outline.bmp